# Altium schematic sheet STM32-PROX_8.SchDoc
size 67 x 42 mm
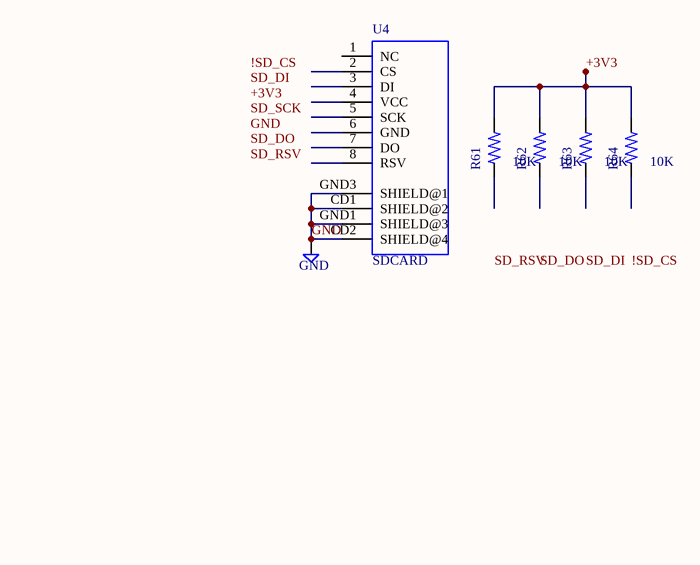
[diagram p0: STM32-PROX_8.SchDoc]

## Parts
GND22  GND
R61  10K  [RLC_0603]
R62  10K  [RLC_0603]
R63  10K  [RLC_0603]
R64  10K  [RLC_0603]
U4  SDCARD  [MICRO-SD-SOCKET-PP]

## Nets
+3V3: R61.2 R62.2 R63.2 R64.2
GND: GND22.0(GND) U4.CD1(SHIELD@2) U4.CD2(SHIELD@4) U4.GND1(SHIELD@3) U4.GND3(SHIELD@1)

Not connected (* = marked no-connect by the designer): R61 1; R62 1; R63 1; R64 1; U4 1(NC) 2(CS) 3(DI) 4(VCC) 5(SCK) 6(GND) 7(DO) 8(RSV)

## Notes on the sheet
- Labels drawn without touching a wire or pin: !SD_CS, +3V3, GND, SD_DI, SD_DO, SD_RSV, SD_SCK

## Library data of the parts
R61-R64 = RESISTORRLC_0603
U4 = USD-SOCKETNEW